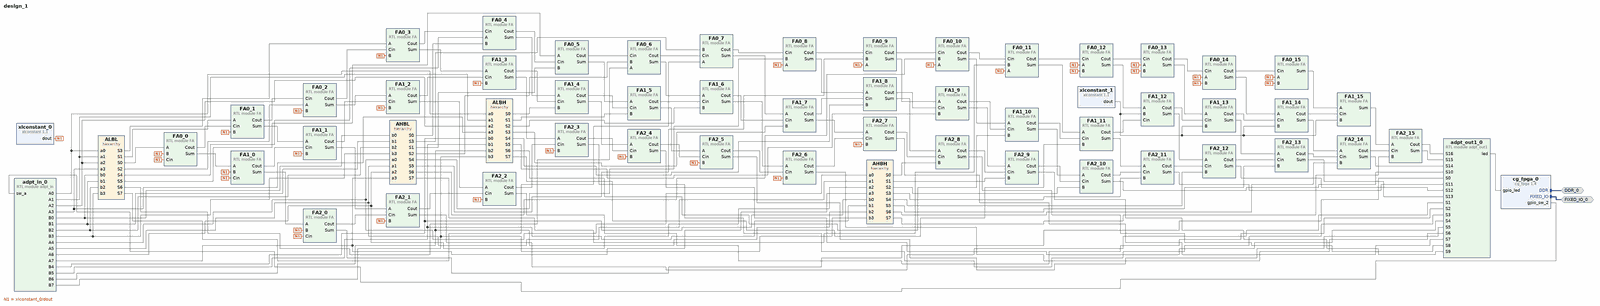
[diagram p0: block diagram of the top level, whole]
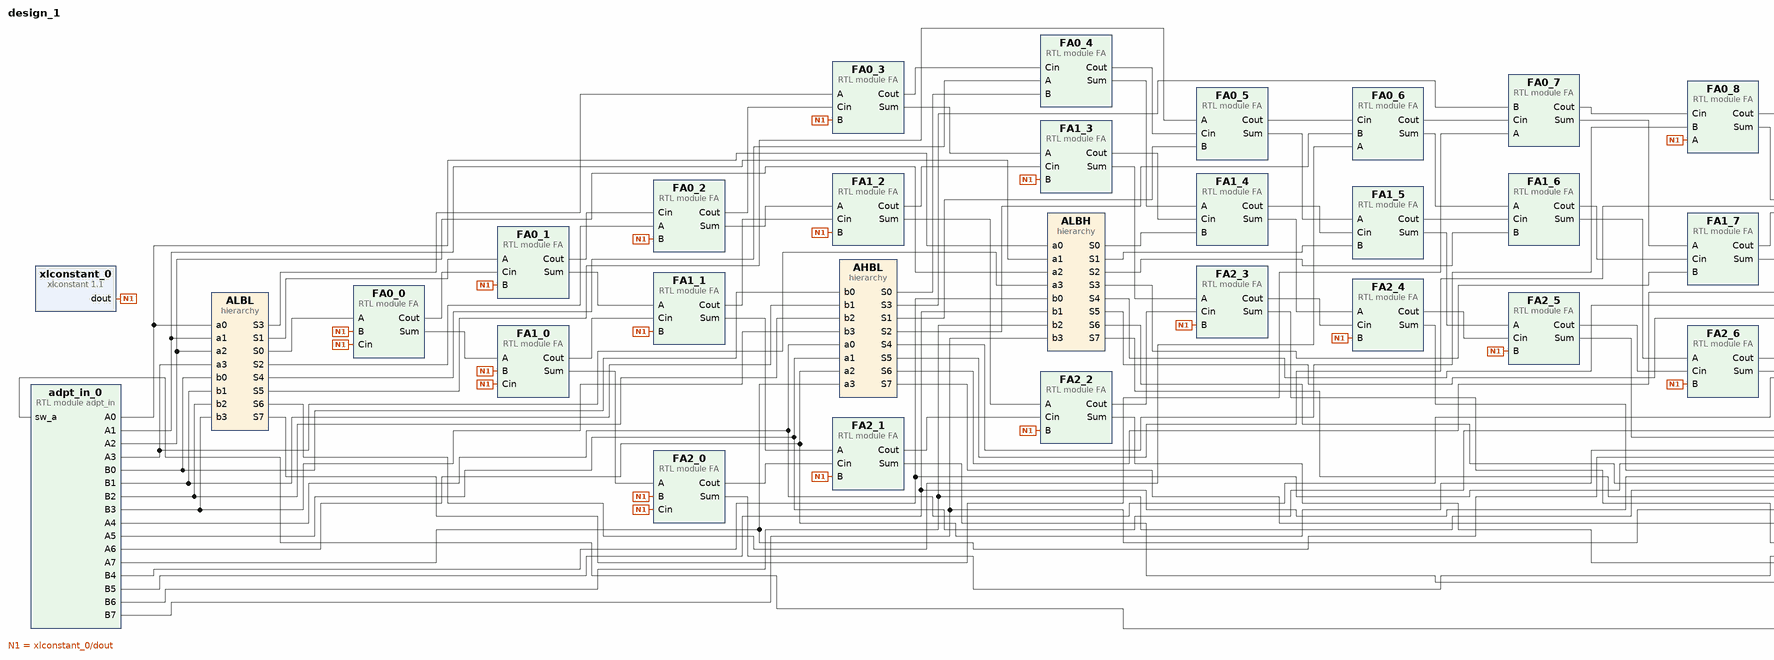
[diagram p1: block diagram of the top level, left part]
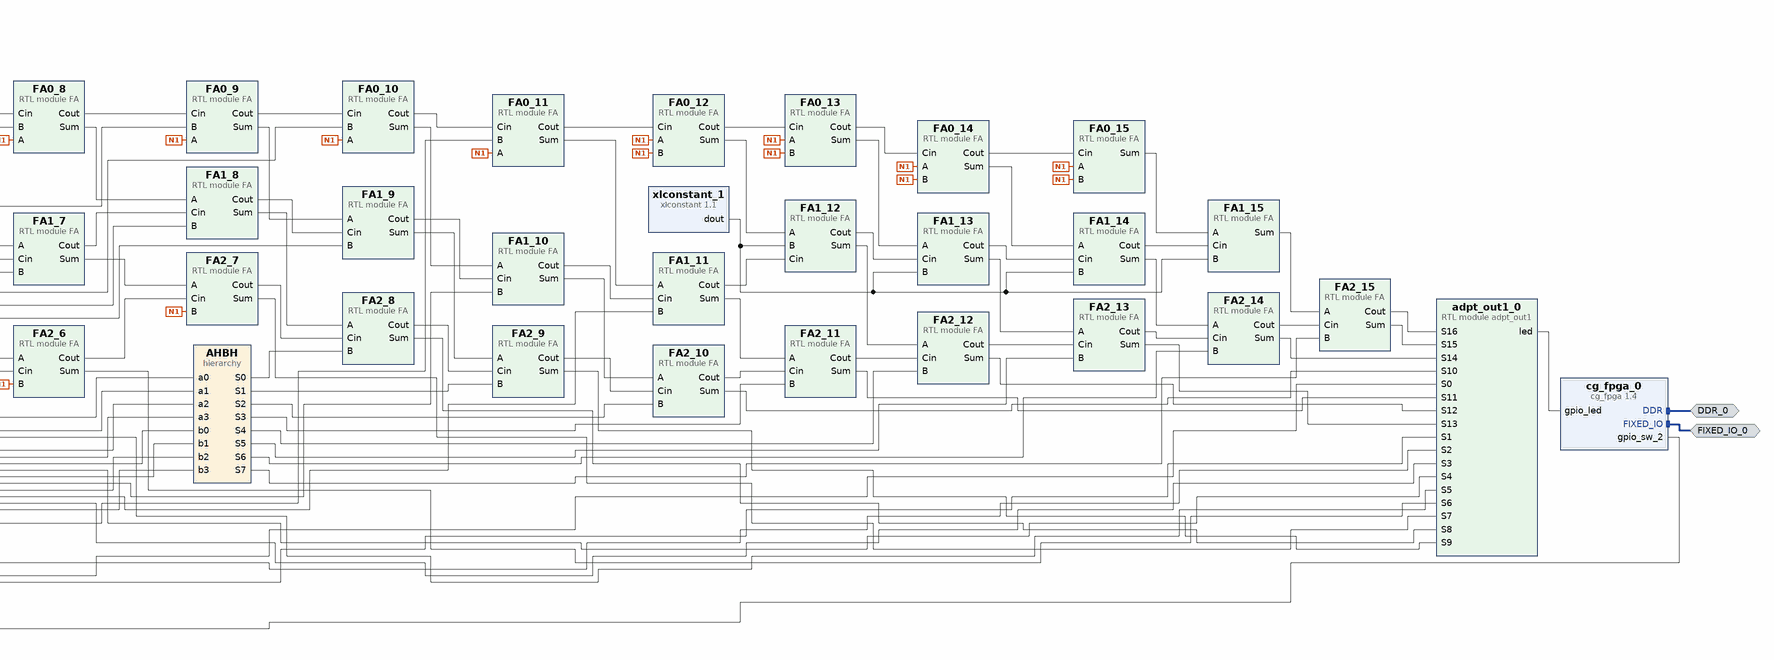
[diagram p2: block diagram of the top level, right part]
# Vivado block design design_1, xc7z020clg400-1, Vivado 2025.1
create_bd_design design_1

create_bd_intf_port -mode Master -vlnv xilinx.com:display_processing_system7:fixedio_rtl:1.0 FIXED_IO_0
create_bd_intf_port -mode Master -vlnv xilinx.com:interface:ddrx_rtl:1.0 DDR_0

create_bd_cell -type ip -vlnv educg.net:user:cg_fpga:1.4 cg_fpga_0
create_bd_cell -type module -reference adpt_in adpt_in_0
create_bd_cell -type hier ALBL
create_bd_cell -type hier ALBH
create_bd_cell -type hier AHBL
create_bd_cell -type hier AHBH
create_bd_cell -type module -reference adpt_out1 adpt_out1_0
create_bd_cell -type module -reference FA FA0_11
create_bd_cell -type module -reference FA FA0_12
create_bd_cell -type module -reference FA FA0_0
create_bd_cell -type module -reference FA FA0_1
create_bd_cell -type module -reference FA FA0_13
create_bd_cell -type module -reference FA FA0_14
create_bd_cell -type module -reference FA FA0_2
create_bd_cell -type module -reference FA FA0_3
create_bd_cell -type ip -vlnv xilinx.com:ip:xlconstant:1.1 xlconstant_0
set_property -dict {CONFIG.CONST_VAL 0} [get_bd_cells xlconstant_0]
create_bd_cell -type module -reference FA FA0_15
create_bd_cell -type module -reference FA FA0_4
create_bd_cell -type module -reference FA FA0_5
create_bd_cell -type module -reference FA FA0_6
create_bd_cell -type module -reference FA FA0_7
create_bd_cell -type module -reference FA FA0_8
create_bd_cell -type module -reference FA FA0_9
create_bd_cell -type module -reference FA FA0_10
create_bd_cell -type module -reference FA FA1_0
create_bd_cell -type module -reference FA FA1_1
create_bd_cell -type module -reference FA FA1_2
create_bd_cell -type module -reference FA FA1_3
create_bd_cell -type module -reference FA FA1_4
create_bd_cell -type module -reference FA FA1_5
create_bd_cell -type module -reference FA FA1_6
create_bd_cell -type module -reference FA FA1_7
create_bd_cell -type module -reference FA FA1_8
create_bd_cell -type module -reference FA FA1_9
create_bd_cell -type module -reference FA FA1_10
create_bd_cell -type module -reference FA FA1_11
create_bd_cell -type module -reference FA FA1_12
create_bd_cell -type module -reference FA FA1_13
create_bd_cell -type module -reference FA FA1_14
create_bd_cell -type module -reference FA FA1_15
create_bd_cell -type ip -vlnv xilinx.com:ip:xlconstant:1.1 xlconstant_1
set_property -dict {CONFIG.CONST_VAL 0} [get_bd_cells xlconstant_1]
create_bd_cell -type module -reference FA FA2_0
create_bd_cell -type module -reference FA FA2_1
create_bd_cell -type module -reference FA FA2_2
create_bd_cell -type module -reference FA FA2_3
create_bd_cell -type module -reference FA FA2_4
create_bd_cell -type module -reference FA FA2_5
create_bd_cell -type module -reference FA FA2_6
create_bd_cell -type module -reference FA FA2_7
create_bd_cell -type module -reference FA FA2_8
create_bd_cell -type module -reference FA FA2_9
create_bd_cell -type module -reference FA FA2_10
create_bd_cell -type module -reference FA FA2_11
create_bd_cell -type module -reference FA FA2_12
create_bd_cell -type module -reference FA FA2_13
create_bd_cell -type module -reference FA FA2_14
create_bd_cell -type module -reference FA FA2_15

# ---- hierarchy /ALBL ----
current_bd_instance /ALBL
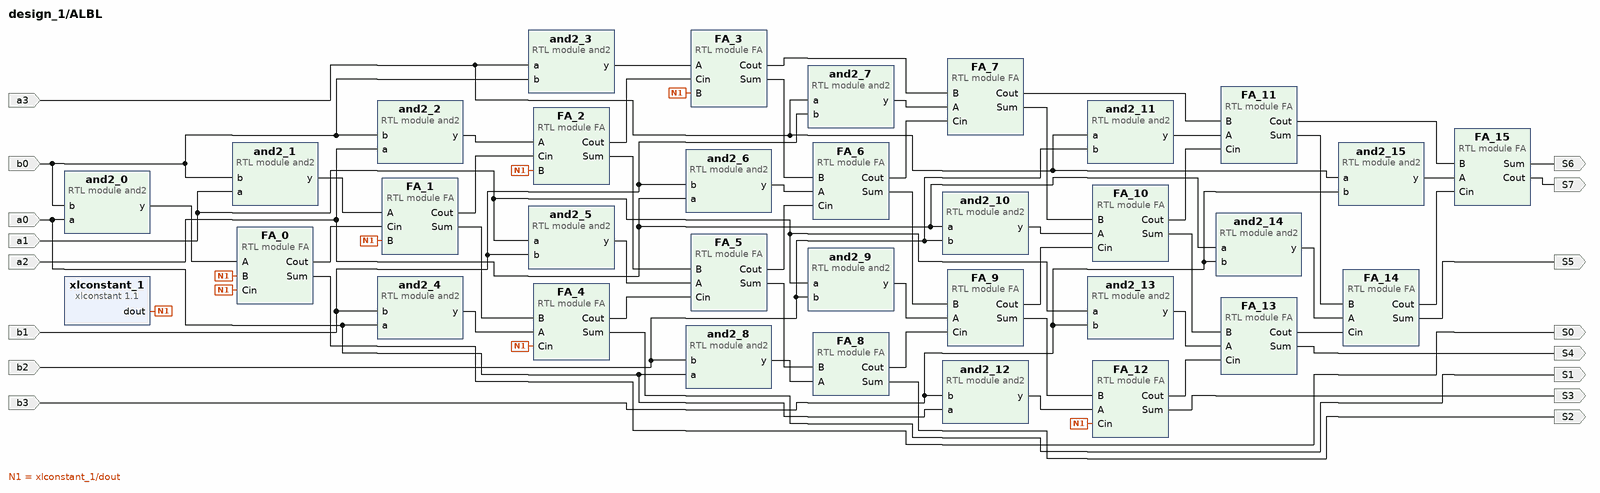
[diagram p3: block diagram inside /ALBL]
create_bd_pin -dir O S6
create_bd_pin -dir O S7
create_bd_pin -dir O S5
create_bd_pin -dir O S4
create_bd_pin -dir O S3
create_bd_pin -dir O S2
create_bd_pin -dir O S1
create_bd_pin -dir O S0
create_bd_pin -dir I a3
create_bd_pin -dir I b3
create_bd_pin -dir I a2
create_bd_pin -dir I a1
create_bd_pin -dir I a0
create_bd_pin -dir I b2
create_bd_pin -dir I b1
create_bd_pin -dir I b0

create_bd_cell -type module -reference FA FA_15
create_bd_cell -type module -reference FA FA_14
create_bd_cell -type module -reference FA FA_13
create_bd_cell -type module -reference FA FA_12
create_bd_cell -type module -reference FA FA_11
create_bd_cell -type module -reference FA FA_10
create_bd_cell -type module -reference FA FA_9
create_bd_cell -type module -reference FA FA_8
create_bd_cell -type module -reference FA FA_7
create_bd_cell -type module -reference FA FA_6
create_bd_cell -type module -reference FA FA_5
create_bd_cell -type module -reference FA FA_4
create_bd_cell -type module -reference FA FA_3
create_bd_cell -type module -reference FA FA_2
create_bd_cell -type module -reference FA FA_1
create_bd_cell -type module -reference FA FA_0
create_bd_cell -type module -reference and2 and2_15
create_bd_cell -type module -reference and2 and2_14
create_bd_cell -type module -reference and2 and2_13
create_bd_cell -type module -reference and2 and2_12
create_bd_cell -type module -reference and2 and2_11
create_bd_cell -type module -reference and2 and2_10
create_bd_cell -type module -reference and2 and2_9
create_bd_cell -type module -reference and2 and2_8
create_bd_cell -type module -reference and2 and2_7
create_bd_cell -type module -reference and2 and2_6
create_bd_cell -type module -reference and2 and2_5
create_bd_cell -type module -reference and2 and2_4
create_bd_cell -type module -reference and2 and2_3
create_bd_cell -type module -reference and2 and2_2
create_bd_cell -type module -reference and2 and2_1
create_bd_cell -type module -reference and2 and2_0
create_bd_cell -type ip -vlnv xilinx.com:ip:xlconstant:1.1 xlconstant_1
set_property -dict {CONFIG.CONST_VAL 0} [get_bd_cells xlconstant_1]

# ---- hierarchy /ALBH ----
current_bd_instance /ALBH
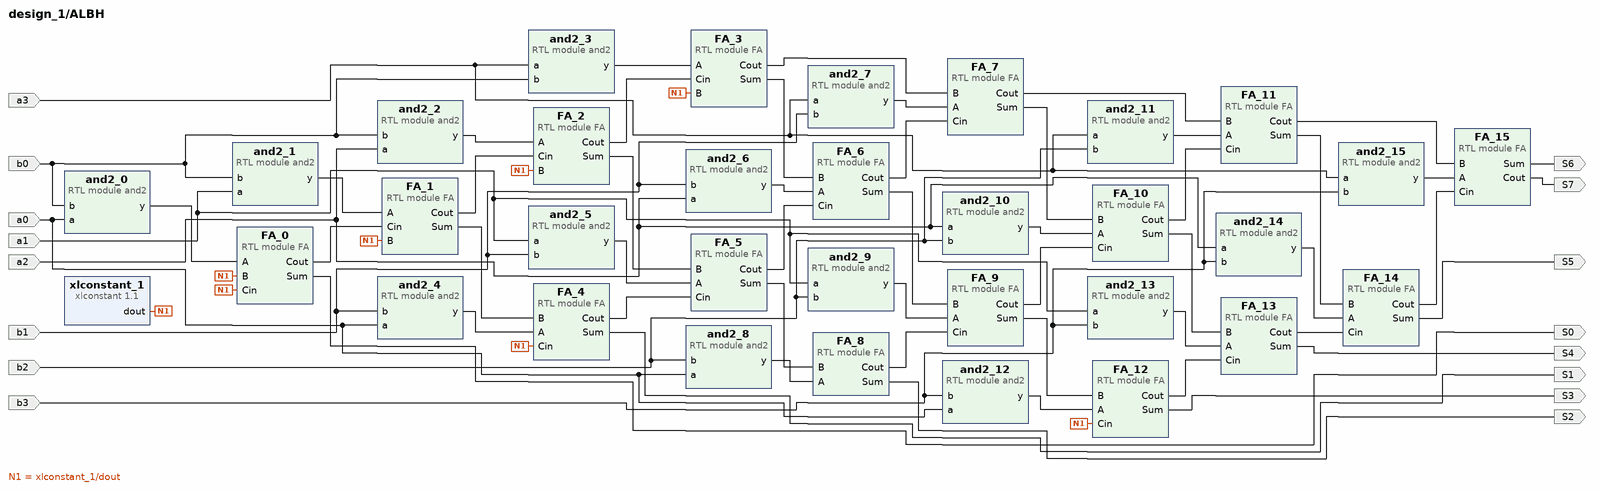
[diagram p4: block diagram inside /ALBH]
create_bd_pin -dir O S6
create_bd_pin -dir O S7
create_bd_pin -dir O S5
create_bd_pin -dir O S4
create_bd_pin -dir O S3
create_bd_pin -dir O S2
create_bd_pin -dir O S1
create_bd_pin -dir O S0
create_bd_pin -dir I a3
create_bd_pin -dir I b3
create_bd_pin -dir I a2
create_bd_pin -dir I a1
create_bd_pin -dir I a0
create_bd_pin -dir I b2
create_bd_pin -dir I b1
create_bd_pin -dir I b0

create_bd_cell -type module -reference FA FA_15
create_bd_cell -type module -reference FA FA_14
create_bd_cell -type module -reference FA FA_13
create_bd_cell -type module -reference FA FA_12
create_bd_cell -type module -reference FA FA_11
create_bd_cell -type module -reference FA FA_10
create_bd_cell -type module -reference FA FA_9
create_bd_cell -type module -reference FA FA_8
create_bd_cell -type module -reference FA FA_7
create_bd_cell -type module -reference FA FA_6
create_bd_cell -type module -reference FA FA_5
create_bd_cell -type module -reference FA FA_4
create_bd_cell -type module -reference FA FA_3
create_bd_cell -type module -reference FA FA_2
create_bd_cell -type module -reference FA FA_1
create_bd_cell -type module -reference FA FA_0
create_bd_cell -type module -reference and2 and2_15
create_bd_cell -type module -reference and2 and2_14
create_bd_cell -type module -reference and2 and2_13
create_bd_cell -type module -reference and2 and2_12
create_bd_cell -type module -reference and2 and2_11
create_bd_cell -type module -reference and2 and2_10
create_bd_cell -type module -reference and2 and2_9
create_bd_cell -type module -reference and2 and2_8
create_bd_cell -type module -reference and2 and2_7
create_bd_cell -type module -reference and2 and2_6
create_bd_cell -type module -reference and2 and2_5
create_bd_cell -type module -reference and2 and2_4
create_bd_cell -type module -reference and2 and2_3
create_bd_cell -type module -reference and2 and2_2
create_bd_cell -type module -reference and2 and2_1
create_bd_cell -type module -reference and2 and2_0
create_bd_cell -type ip -vlnv xilinx.com:ip:xlconstant:1.1 xlconstant_1
set_property -dict {CONFIG.CONST_VAL 0} [get_bd_cells xlconstant_1]

# ---- hierarchy /AHBL ----
current_bd_instance /AHBL
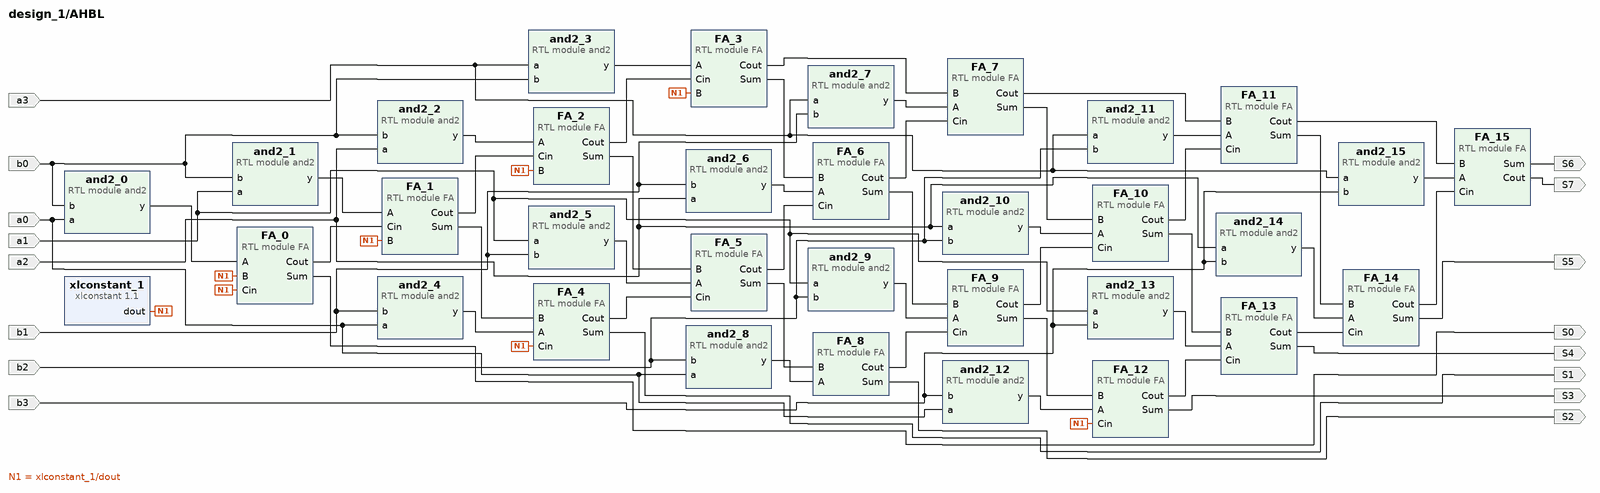
[diagram p5: block diagram inside /AHBL]
create_bd_pin -dir O S6
create_bd_pin -dir O S7
create_bd_pin -dir O S5
create_bd_pin -dir O S4
create_bd_pin -dir O S3
create_bd_pin -dir O S2
create_bd_pin -dir O S1
create_bd_pin -dir O S0
create_bd_pin -dir I a3
create_bd_pin -dir I b3
create_bd_pin -dir I a2
create_bd_pin -dir I a1
create_bd_pin -dir I a0
create_bd_pin -dir I b2
create_bd_pin -dir I b1
create_bd_pin -dir I b0

create_bd_cell -type module -reference FA FA_15
create_bd_cell -type module -reference FA FA_14
create_bd_cell -type module -reference FA FA_13
create_bd_cell -type module -reference FA FA_12
create_bd_cell -type module -reference FA FA_11
create_bd_cell -type module -reference FA FA_10
create_bd_cell -type module -reference FA FA_9
create_bd_cell -type module -reference FA FA_8
create_bd_cell -type module -reference FA FA_7
create_bd_cell -type module -reference FA FA_6
create_bd_cell -type module -reference FA FA_5
create_bd_cell -type module -reference FA FA_4
create_bd_cell -type module -reference FA FA_3
create_bd_cell -type module -reference FA FA_2
create_bd_cell -type module -reference FA FA_1
create_bd_cell -type module -reference FA FA_0
create_bd_cell -type module -reference and2 and2_15
create_bd_cell -type module -reference and2 and2_14
create_bd_cell -type module -reference and2 and2_13
create_bd_cell -type module -reference and2 and2_12
create_bd_cell -type module -reference and2 and2_11
create_bd_cell -type module -reference and2 and2_10
create_bd_cell -type module -reference and2 and2_9
create_bd_cell -type module -reference and2 and2_8
create_bd_cell -type module -reference and2 and2_7
create_bd_cell -type module -reference and2 and2_6
create_bd_cell -type module -reference and2 and2_5
create_bd_cell -type module -reference and2 and2_4
create_bd_cell -type module -reference and2 and2_3
create_bd_cell -type module -reference and2 and2_2
create_bd_cell -type module -reference and2 and2_1
create_bd_cell -type module -reference and2 and2_0
create_bd_cell -type ip -vlnv xilinx.com:ip:xlconstant:1.1 xlconstant_1
set_property -dict {CONFIG.CONST_VAL 0} [get_bd_cells xlconstant_1]

# ---- hierarchy /AHBH ----
current_bd_instance /AHBH
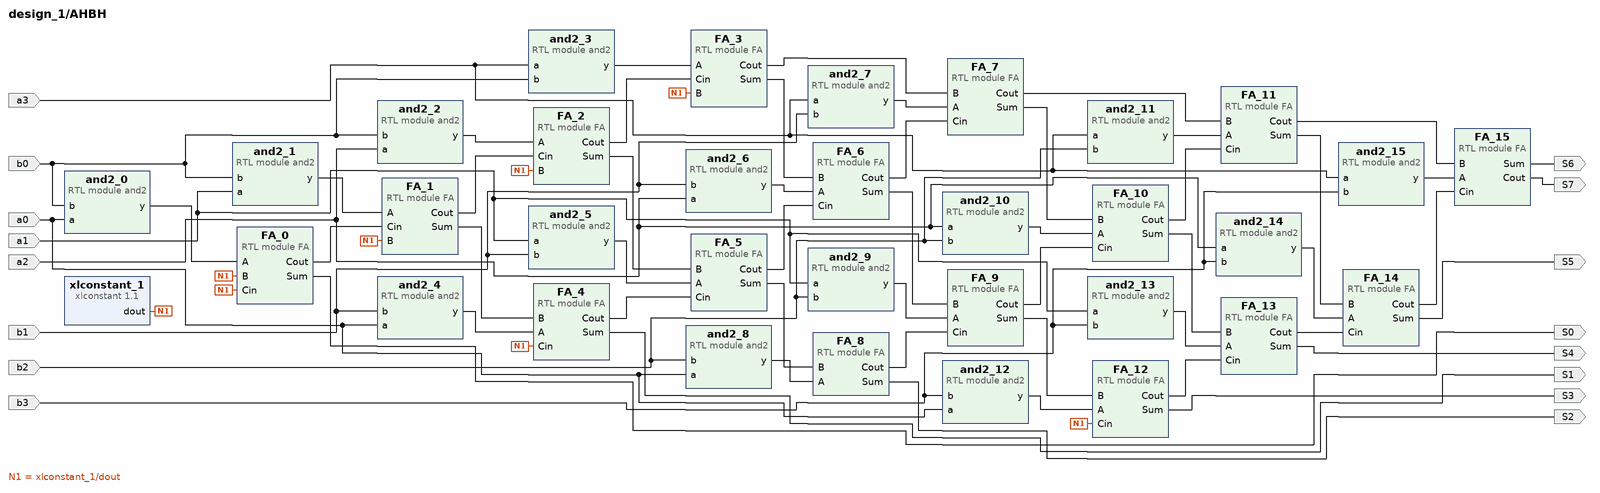
[diagram p6: block diagram inside /AHBH]
create_bd_pin -dir O S6
create_bd_pin -dir O S7
create_bd_pin -dir O S5
create_bd_pin -dir O S4
create_bd_pin -dir O S3
create_bd_pin -dir O S2
create_bd_pin -dir O S1
create_bd_pin -dir O S0
create_bd_pin -dir I a3
create_bd_pin -dir I b3
create_bd_pin -dir I a2
create_bd_pin -dir I a1
create_bd_pin -dir I a0
create_bd_pin -dir I b2
create_bd_pin -dir I b1
create_bd_pin -dir I b0

create_bd_cell -type module -reference FA FA_15
create_bd_cell -type module -reference FA FA_14
create_bd_cell -type module -reference FA FA_13
create_bd_cell -type module -reference FA FA_12
create_bd_cell -type module -reference FA FA_11
create_bd_cell -type module -reference FA FA_10
create_bd_cell -type module -reference FA FA_9
create_bd_cell -type module -reference FA FA_8
create_bd_cell -type module -reference FA FA_7
create_bd_cell -type module -reference FA FA_6
create_bd_cell -type module -reference FA FA_5
create_bd_cell -type module -reference FA FA_4
create_bd_cell -type module -reference FA FA_3
create_bd_cell -type module -reference FA FA_2
create_bd_cell -type module -reference FA FA_1
create_bd_cell -type module -reference FA FA_0
create_bd_cell -type module -reference and2 and2_15
create_bd_cell -type module -reference and2 and2_14
create_bd_cell -type module -reference and2 and2_13
create_bd_cell -type module -reference and2 and2_12
create_bd_cell -type module -reference and2 and2_11
create_bd_cell -type module -reference and2 and2_10
create_bd_cell -type module -reference and2 and2_9
create_bd_cell -type module -reference and2 and2_8
create_bd_cell -type module -reference and2 and2_7
create_bd_cell -type module -reference and2 and2_6
create_bd_cell -type module -reference and2 and2_5
create_bd_cell -type module -reference and2 and2_4
create_bd_cell -type module -reference and2 and2_3
create_bd_cell -type module -reference and2 and2_2
create_bd_cell -type module -reference and2 and2_1
create_bd_cell -type module -reference and2 and2_0
create_bd_cell -type ip -vlnv xilinx.com:ip:xlconstant:1.1 xlconstant_1
set_property -dict {CONFIG.CONST_VAL 0} [get_bd_cells xlconstant_1]

# ---- connections ----

current_bd_instance /ALBL
connect_bd_net [get_bd_pins FA_0/Cout] [get_bd_pins FA_1/Cin]
connect_bd_net [get_bd_pins FA_0/Sum] [get_bd_pins S0]
connect_bd_net [get_bd_pins FA_10/Cout] [get_bd_pins FA_11/Cin]
connect_bd_net [get_bd_pins FA_10/Sum] [get_bd_pins FA_13/B]
connect_bd_net [get_bd_pins FA_11/Cout] [get_bd_pins FA_15/B]
connect_bd_net [get_bd_pins FA_11/Sum] [get_bd_pins FA_14/B]
connect_bd_net [get_bd_pins FA_12/Cout] [get_bd_pins FA_13/Cin]
connect_bd_net [get_bd_pins FA_12/Sum] [get_bd_pins S3]
connect_bd_net [get_bd_pins FA_13/Cout] [get_bd_pins FA_14/Cin]
connect_bd_net [get_bd_pins FA_13/Sum] [get_bd_pins S4]
connect_bd_net [get_bd_pins FA_14/Cout] [get_bd_pins FA_15/Cin]
connect_bd_net [get_bd_pins FA_14/Sum] [get_bd_pins S5]
connect_bd_net [get_bd_pins FA_15/Cout] [get_bd_pins S7]
connect_bd_net [get_bd_pins FA_15/Sum] [get_bd_pins S6]
connect_bd_net [get_bd_pins FA_1/Cout] [get_bd_pins FA_2/Cin]
connect_bd_net [get_bd_pins FA_1/Sum] [get_bd_pins FA_4/B]
connect_bd_net [get_bd_pins FA_2/Cout] [get_bd_pins FA_3/Cin]
connect_bd_net [get_bd_pins FA_2/Sum] [get_bd_pins FA_5/B]
connect_bd_net [get_bd_pins FA_3/Cout] [get_bd_pins FA_7/B]
connect_bd_net [get_bd_pins FA_3/Sum] [get_bd_pins FA_6/B]
connect_bd_net [get_bd_pins FA_4/Cout] [get_bd_pins FA_5/Cin]
connect_bd_net [get_bd_pins FA_4/Sum] [get_bd_pins S1]
connect_bd_net [get_bd_pins FA_5/Cout] [get_bd_pins FA_6/Cin]
connect_bd_net [get_bd_pins FA_5/Sum] [get_bd_pins FA_8/B]
connect_bd_net [get_bd_pins FA_6/Cout] [get_bd_pins FA_7/Cin]
connect_bd_net [get_bd_pins FA_6/Sum] [get_bd_pins FA_9/B]
connect_bd_net [get_bd_pins FA_7/Cout] [get_bd_pins FA_11/B]
connect_bd_net [get_bd_pins FA_7/Sum] [get_bd_pins FA_10/B]
connect_bd_net [get_bd_pins FA_8/Cout] [get_bd_pins FA_9/Cin]
connect_bd_net [get_bd_pins FA_8/Sum] [get_bd_pins S2]
connect_bd_net [get_bd_pins FA_9/Cout] [get_bd_pins FA_10/Cin]
connect_bd_net [get_bd_pins FA_9/Sum] [get_bd_pins FA_12/B]
connect_bd_net -net adpt_in_0_A0 [get_bd_pins a0] [get_bd_pins and2_0/a] [get_bd_pins and2_4/a] [get_bd_pins and2_8/a] [get_bd_pins and2_12/a]
connect_bd_net -net adpt_in_0_A1 [get_bd_pins a1] [get_bd_pins and2_1/a] [get_bd_pins and2_5/a] [get_bd_pins and2_9/a] [get_bd_pins and2_13/a]
connect_bd_net -net adpt_in_0_A2 [get_bd_pins a2] [get_bd_pins and2_2/a] [get_bd_pins and2_6/a] [get_bd_pins and2_10/a] [get_bd_pins and2_14/a]
connect_bd_net -net adpt_in_0_A3 [get_bd_pins a3] [get_bd_pins and2_3/a] [get_bd_pins and2_7/a] [get_bd_pins and2_11/a] [get_bd_pins and2_15/a]
connect_bd_net -net adpt_in_0_B0 [get_bd_pins b0] [get_bd_pins and2_0/b] [get_bd_pins and2_1/b] [get_bd_pins and2_2/b] [get_bd_pins and2_3/b]
connect_bd_net -net adpt_in_0_B1 [get_bd_pins b1] [get_bd_pins and2_4/b] [get_bd_pins and2_5/b] [get_bd_pins and2_6/b] [get_bd_pins and2_7/b]
connect_bd_net -net adpt_in_0_B2 [get_bd_pins b2] [get_bd_pins and2_8/b] [get_bd_pins and2_9/b] [get_bd_pins and2_10/b] [get_bd_pins and2_11/b]
connect_bd_net -net adpt_in_0_B3 [get_bd_pins b3] [get_bd_pins and2_14/b] [get_bd_pins and2_13/b] [get_bd_pins and2_12/b] [get_bd_pins and2_15/b]
connect_bd_net [get_bd_pins and2_0/y] [get_bd_pins FA_0/A]
connect_bd_net [get_bd_pins and2_10/y] [get_bd_pins FA_10/A]
connect_bd_net [get_bd_pins and2_11/y] [get_bd_pins FA_11/A]
connect_bd_net [get_bd_pins and2_12/y] [get_bd_pins FA_12/A]
connect_bd_net [get_bd_pins and2_13/y] [get_bd_pins FA_13/A]
connect_bd_net [get_bd_pins and2_14/y] [get_bd_pins FA_14/A]
connect_bd_net [get_bd_pins and2_15/y] [get_bd_pins FA_15/A]
connect_bd_net [get_bd_pins and2_1/y] [get_bd_pins FA_1/A]
connect_bd_net [get_bd_pins and2_2/y] [get_bd_pins FA_2/A]
connect_bd_net [get_bd_pins and2_3/y] [get_bd_pins FA_3/A]
connect_bd_net [get_bd_pins and2_4/y] [get_bd_pins FA_4/A]
connect_bd_net [get_bd_pins and2_5/y] [get_bd_pins FA_5/A]
connect_bd_net [get_bd_pins and2_6/y] [get_bd_pins FA_6/A]
connect_bd_net [get_bd_pins and2_7/y] [get_bd_pins FA_7/A]
connect_bd_net [get_bd_pins and2_8/y] [get_bd_pins FA_8/A]
connect_bd_net [get_bd_pins and2_9/y] [get_bd_pins FA_9/A]
connect_bd_net -net xlconstant_0_dout [get_bd_pins xlconstant_1/dout] \
  [get_bd_pins FA_0/B] [get_bd_pins FA_0/Cin] [get_bd_pins FA_1/B] [get_bd_pins FA_2/B] [get_bd_pins FA_3/B] \
  [get_bd_pins FA_4/Cin] [get_bd_pins FA_12/Cin]

current_bd_instance /ALBH
connect_bd_net [get_bd_pins FA_0/Cout] [get_bd_pins FA_1/Cin]
connect_bd_net [get_bd_pins FA_0/Sum] [get_bd_pins S0]
connect_bd_net [get_bd_pins FA_10/Cout] [get_bd_pins FA_11/Cin]
connect_bd_net [get_bd_pins FA_10/Sum] [get_bd_pins FA_13/B]
connect_bd_net [get_bd_pins FA_11/Cout] [get_bd_pins FA_15/B]
connect_bd_net [get_bd_pins FA_11/Sum] [get_bd_pins FA_14/B]
connect_bd_net [get_bd_pins FA_12/Cout] [get_bd_pins FA_13/Cin]
connect_bd_net [get_bd_pins FA_12/Sum] [get_bd_pins S3]
connect_bd_net [get_bd_pins FA_13/Cout] [get_bd_pins FA_14/Cin]
connect_bd_net [get_bd_pins FA_13/Sum] [get_bd_pins S4]
connect_bd_net [get_bd_pins FA_14/Cout] [get_bd_pins FA_15/Cin]
connect_bd_net [get_bd_pins FA_14/Sum] [get_bd_pins S5]
connect_bd_net [get_bd_pins FA_15/Cout] [get_bd_pins S7]
connect_bd_net [get_bd_pins FA_15/Sum] [get_bd_pins S6]
connect_bd_net [get_bd_pins FA_1/Cout] [get_bd_pins FA_2/Cin]
connect_bd_net [get_bd_pins FA_1/Sum] [get_bd_pins FA_4/B]
connect_bd_net [get_bd_pins FA_2/Cout] [get_bd_pins FA_3/Cin]
connect_bd_net [get_bd_pins FA_2/Sum] [get_bd_pins FA_5/B]
connect_bd_net [get_bd_pins FA_3/Cout] [get_bd_pins FA_7/B]
connect_bd_net [get_bd_pins FA_3/Sum] [get_bd_pins FA_6/B]
connect_bd_net [get_bd_pins FA_4/Cout] [get_bd_pins FA_5/Cin]
connect_bd_net [get_bd_pins FA_4/Sum] [get_bd_pins S1]
connect_bd_net [get_bd_pins FA_5/Cout] [get_bd_pins FA_6/Cin]
connect_bd_net [get_bd_pins FA_5/Sum] [get_bd_pins FA_8/B]
connect_bd_net [get_bd_pins FA_6/Cout] [get_bd_pins FA_7/Cin]
connect_bd_net [get_bd_pins FA_6/Sum] [get_bd_pins FA_9/B]
connect_bd_net [get_bd_pins FA_7/Cout] [get_bd_pins FA_11/B]
connect_bd_net [get_bd_pins FA_7/Sum] [get_bd_pins FA_10/B]
connect_bd_net [get_bd_pins FA_8/Cout] [get_bd_pins FA_9/Cin]
connect_bd_net [get_bd_pins FA_8/Sum] [get_bd_pins S2]
connect_bd_net [get_bd_pins FA_9/Cout] [get_bd_pins FA_10/Cin]
connect_bd_net [get_bd_pins FA_9/Sum] [get_bd_pins FA_12/B]
connect_bd_net -net adpt_in_0_A0 [get_bd_pins a0] [get_bd_pins and2_0/a] [get_bd_pins and2_4/a] [get_bd_pins and2_8/a] [get_bd_pins and2_12/a]
connect_bd_net -net adpt_in_0_A1 [get_bd_pins a1] [get_bd_pins and2_1/a] [get_bd_pins and2_5/a] [get_bd_pins and2_9/a] [get_bd_pins and2_13/a]
connect_bd_net -net adpt_in_0_A2 [get_bd_pins a2] [get_bd_pins and2_2/a] [get_bd_pins and2_6/a] [get_bd_pins and2_10/a] [get_bd_pins and2_14/a]
connect_bd_net -net adpt_in_0_A3 [get_bd_pins a3] [get_bd_pins and2_3/a] [get_bd_pins and2_7/a] [get_bd_pins and2_11/a] [get_bd_pins and2_15/a]
connect_bd_net -net adpt_in_0_B0 [get_bd_pins b0] [get_bd_pins and2_0/b] [get_bd_pins and2_1/b] [get_bd_pins and2_2/b] [get_bd_pins and2_3/b]
connect_bd_net -net adpt_in_0_B1 [get_bd_pins b1] [get_bd_pins and2_4/b] [get_bd_pins and2_5/b] [get_bd_pins and2_6/b] [get_bd_pins and2_7/b]
connect_bd_net -net adpt_in_0_B2 [get_bd_pins b2] [get_bd_pins and2_8/b] [get_bd_pins and2_9/b] [get_bd_pins and2_10/b] [get_bd_pins and2_11/b]
connect_bd_net -net adpt_in_0_B3 [get_bd_pins b3] [get_bd_pins and2_14/b] [get_bd_pins and2_13/b] [get_bd_pins and2_12/b] [get_bd_pins and2_15/b]
connect_bd_net [get_bd_pins and2_0/y] [get_bd_pins FA_0/A]
connect_bd_net [get_bd_pins and2_10/y] [get_bd_pins FA_10/A]
connect_bd_net [get_bd_pins and2_11/y] [get_bd_pins FA_11/A]
connect_bd_net [get_bd_pins and2_12/y] [get_bd_pins FA_12/A]
connect_bd_net [get_bd_pins and2_13/y] [get_bd_pins FA_13/A]
connect_bd_net [get_bd_pins and2_14/y] [get_bd_pins FA_14/A]
connect_bd_net [get_bd_pins and2_15/y] [get_bd_pins FA_15/A]
connect_bd_net [get_bd_pins and2_1/y] [get_bd_pins FA_1/A]
connect_bd_net [get_bd_pins and2_2/y] [get_bd_pins FA_2/A]
connect_bd_net [get_bd_pins and2_3/y] [get_bd_pins FA_3/A]
connect_bd_net [get_bd_pins and2_4/y] [get_bd_pins FA_4/A]
connect_bd_net [get_bd_pins and2_5/y] [get_bd_pins FA_5/A]
connect_bd_net [get_bd_pins and2_6/y] [get_bd_pins FA_6/A]
connect_bd_net [get_bd_pins and2_7/y] [get_bd_pins FA_7/A]
connect_bd_net [get_bd_pins and2_8/y] [get_bd_pins FA_8/A]
connect_bd_net [get_bd_pins and2_9/y] [get_bd_pins FA_9/A]
connect_bd_net -net xlconstant_0_dout [get_bd_pins xlconstant_1/dout] \
  [get_bd_pins FA_0/B] [get_bd_pins FA_0/Cin] [get_bd_pins FA_1/B] [get_bd_pins FA_2/B] [get_bd_pins FA_3/B] \
  [get_bd_pins FA_4/Cin] [get_bd_pins FA_12/Cin]

current_bd_instance /AHBL
connect_bd_net [get_bd_pins FA_0/Cout] [get_bd_pins FA_1/Cin]
connect_bd_net [get_bd_pins FA_0/Sum] [get_bd_pins S0]
connect_bd_net [get_bd_pins FA_10/Cout] [get_bd_pins FA_11/Cin]
connect_bd_net [get_bd_pins FA_10/Sum] [get_bd_pins FA_13/B]
connect_bd_net [get_bd_pins FA_11/Cout] [get_bd_pins FA_15/B]
connect_bd_net [get_bd_pins FA_11/Sum] [get_bd_pins FA_14/B]
connect_bd_net [get_bd_pins FA_12/Cout] [get_bd_pins FA_13/Cin]
connect_bd_net [get_bd_pins FA_12/Sum] [get_bd_pins S3]
connect_bd_net [get_bd_pins FA_13/Cout] [get_bd_pins FA_14/Cin]
connect_bd_net [get_bd_pins FA_13/Sum] [get_bd_pins S4]
connect_bd_net [get_bd_pins FA_14/Cout] [get_bd_pins FA_15/Cin]
connect_bd_net [get_bd_pins FA_14/Sum] [get_bd_pins S5]
connect_bd_net [get_bd_pins FA_15/Cout] [get_bd_pins S7]
connect_bd_net [get_bd_pins FA_15/Sum] [get_bd_pins S6]
connect_bd_net [get_bd_pins FA_1/Cout] [get_bd_pins FA_2/Cin]
connect_bd_net [get_bd_pins FA_1/Sum] [get_bd_pins FA_4/B]
connect_bd_net [get_bd_pins FA_2/Cout] [get_bd_pins FA_3/Cin]
connect_bd_net [get_bd_pins FA_2/Sum] [get_bd_pins FA_5/B]
connect_bd_net [get_bd_pins FA_3/Cout] [get_bd_pins FA_7/B]
connect_bd_net [get_bd_pins FA_3/Sum] [get_bd_pins FA_6/B]
connect_bd_net [get_bd_pins FA_4/Cout] [get_bd_pins FA_5/Cin]
connect_bd_net [get_bd_pins FA_4/Sum] [get_bd_pins S1]
connect_bd_net [get_bd_pins FA_5/Cout] [get_bd_pins FA_6/Cin]
connect_bd_net [get_bd_pins FA_5/Sum] [get_bd_pins FA_8/B]
connect_bd_net [get_bd_pins FA_6/Cout] [get_bd_pins FA_7/Cin]
connect_bd_net [get_bd_pins FA_6/Sum] [get_bd_pins FA_9/B]
connect_bd_net [get_bd_pins FA_7/Cout] [get_bd_pins FA_11/B]
connect_bd_net [get_bd_pins FA_7/Sum] [get_bd_pins FA_10/B]
connect_bd_net [get_bd_pins FA_8/Cout] [get_bd_pins FA_9/Cin]
connect_bd_net [get_bd_pins FA_8/Sum] [get_bd_pins S2]
connect_bd_net [get_bd_pins FA_9/Cout] [get_bd_pins FA_10/Cin]
connect_bd_net [get_bd_pins FA_9/Sum] [get_bd_pins FA_12/B]
connect_bd_net -net adpt_in_0_A0 [get_bd_pins a0] [get_bd_pins and2_0/a] [get_bd_pins and2_4/a] [get_bd_pins and2_8/a] [get_bd_pins and2_12/a]
connect_bd_net -net adpt_in_0_A1 [get_bd_pins a1] [get_bd_pins and2_1/a] [get_bd_pins and2_5/a] [get_bd_pins and2_9/a] [get_bd_pins and2_13/a]
connect_bd_net -net adpt_in_0_A2 [get_bd_pins a2] [get_bd_pins and2_2/a] [get_bd_pins and2_6/a] [get_bd_pins and2_10/a] [get_bd_pins and2_14/a]
connect_bd_net -net adpt_in_0_A3 [get_bd_pins a3] [get_bd_pins and2_3/a] [get_bd_pins and2_7/a] [get_bd_pins and2_11/a] [get_bd_pins and2_15/a]
connect_bd_net -net adpt_in_0_B0 [get_bd_pins b0] [get_bd_pins and2_0/b] [get_bd_pins and2_1/b] [get_bd_pins and2_2/b] [get_bd_pins and2_3/b]
connect_bd_net -net adpt_in_0_B1 [get_bd_pins b1] [get_bd_pins and2_4/b] [get_bd_pins and2_5/b] [get_bd_pins and2_6/b] [get_bd_pins and2_7/b]
connect_bd_net -net adpt_in_0_B2 [get_bd_pins b2] [get_bd_pins and2_8/b] [get_bd_pins and2_9/b] [get_bd_pins and2_10/b] [get_bd_pins and2_11/b]
connect_bd_net -net adpt_in_0_B3 [get_bd_pins b3] [get_bd_pins and2_14/b] [get_bd_pins and2_13/b] [get_bd_pins and2_12/b] [get_bd_pins and2_15/b]
connect_bd_net [get_bd_pins and2_0/y] [get_bd_pins FA_0/A]
connect_bd_net [get_bd_pins and2_10/y] [get_bd_pins FA_10/A]
connect_bd_net [get_bd_pins and2_11/y] [get_bd_pins FA_11/A]
connect_bd_net [get_bd_pins and2_12/y] [get_bd_pins FA_12/A]
connect_bd_net [get_bd_pins and2_13/y] [get_bd_pins FA_13/A]
connect_bd_net [get_bd_pins and2_14/y] [get_bd_pins FA_14/A]
connect_bd_net [get_bd_pins and2_15/y] [get_bd_pins FA_15/A]
connect_bd_net [get_bd_pins and2_1/y] [get_bd_pins FA_1/A]
connect_bd_net [get_bd_pins and2_2/y] [get_bd_pins FA_2/A]
connect_bd_net [get_bd_pins and2_3/y] [get_bd_pins FA_3/A]
connect_bd_net [get_bd_pins and2_4/y] [get_bd_pins FA_4/A]
connect_bd_net [get_bd_pins and2_5/y] [get_bd_pins FA_5/A]
connect_bd_net [get_bd_pins and2_6/y] [get_bd_pins FA_6/A]
connect_bd_net [get_bd_pins and2_7/y] [get_bd_pins FA_7/A]
connect_bd_net [get_bd_pins and2_8/y] [get_bd_pins FA_8/A]
connect_bd_net [get_bd_pins and2_9/y] [get_bd_pins FA_9/A]
connect_bd_net -net xlconstant_0_dout [get_bd_pins xlconstant_1/dout] \
  [get_bd_pins FA_0/B] [get_bd_pins FA_0/Cin] [get_bd_pins FA_1/B] [get_bd_pins FA_2/B] [get_bd_pins FA_3/B] \
  [get_bd_pins FA_4/Cin] [get_bd_pins FA_12/Cin]

current_bd_instance /AHBH
connect_bd_net [get_bd_pins FA_0/Cout] [get_bd_pins FA_1/Cin]
connect_bd_net [get_bd_pins FA_0/Sum] [get_bd_pins S0]
connect_bd_net [get_bd_pins FA_10/Cout] [get_bd_pins FA_11/Cin]
connect_bd_net [get_bd_pins FA_10/Sum] [get_bd_pins FA_13/B]
connect_bd_net [get_bd_pins FA_11/Cout] [get_bd_pins FA_15/B]
connect_bd_net [get_bd_pins FA_11/Sum] [get_bd_pins FA_14/B]
connect_bd_net [get_bd_pins FA_12/Cout] [get_bd_pins FA_13/Cin]
connect_bd_net [get_bd_pins FA_12/Sum] [get_bd_pins S3]
connect_bd_net [get_bd_pins FA_13/Cout] [get_bd_pins FA_14/Cin]
connect_bd_net [get_bd_pins FA_13/Sum] [get_bd_pins S4]
connect_bd_net [get_bd_pins FA_14/Cout] [get_bd_pins FA_15/Cin]
connect_bd_net [get_bd_pins FA_14/Sum] [get_bd_pins S5]
connect_bd_net [get_bd_pins FA_15/Cout] [get_bd_pins S7]
connect_bd_net [get_bd_pins FA_15/Sum] [get_bd_pins S6]
connect_bd_net [get_bd_pins FA_1/Cout] [get_bd_pins FA_2/Cin]
connect_bd_net [get_bd_pins FA_1/Sum] [get_bd_pins FA_4/B]
connect_bd_net [get_bd_pins FA_2/Cout] [get_bd_pins FA_3/Cin]
connect_bd_net [get_bd_pins FA_2/Sum] [get_bd_pins FA_5/B]
connect_bd_net [get_bd_pins FA_3/Cout] [get_bd_pins FA_7/B]
connect_bd_net [get_bd_pins FA_3/Sum] [get_bd_pins FA_6/B]
connect_bd_net [get_bd_pins FA_4/Cout] [get_bd_pins FA_5/Cin]
connect_bd_net [get_bd_pins FA_4/Sum] [get_bd_pins S1]
connect_bd_net [get_bd_pins FA_5/Cout] [get_bd_pins FA_6/Cin]
connect_bd_net [get_bd_pins FA_5/Sum] [get_bd_pins FA_8/B]
connect_bd_net [get_bd_pins FA_6/Cout] [get_bd_pins FA_7/Cin]
connect_bd_net [get_bd_pins FA_6/Sum] [get_bd_pins FA_9/B]
connect_bd_net [get_bd_pins FA_7/Cout] [get_bd_pins FA_11/B]
connect_bd_net [get_bd_pins FA_7/Sum] [get_bd_pins FA_10/B]
connect_bd_net [get_bd_pins FA_8/Cout] [get_bd_pins FA_9/Cin]
connect_bd_net [get_bd_pins FA_8/Sum] [get_bd_pins S2]
connect_bd_net [get_bd_pins FA_9/Cout] [get_bd_pins FA_10/Cin]
connect_bd_net [get_bd_pins FA_9/Sum] [get_bd_pins FA_12/B]
connect_bd_net -net adpt_in_0_A0 [get_bd_pins a0] [get_bd_pins and2_0/a] [get_bd_pins and2_4/a] [get_bd_pins and2_8/a] [get_bd_pins and2_12/a]
connect_bd_net -net adpt_in_0_A1 [get_bd_pins a1] [get_bd_pins and2_1/a] [get_bd_pins and2_5/a] [get_bd_pins and2_9/a] [get_bd_pins and2_13/a]
connect_bd_net -net adpt_in_0_A2 [get_bd_pins a2] [get_bd_pins and2_2/a] [get_bd_pins and2_6/a] [get_bd_pins and2_10/a] [get_bd_pins and2_14/a]
connect_bd_net -net adpt_in_0_A3 [get_bd_pins a3] [get_bd_pins and2_3/a] [get_bd_pins and2_7/a] [get_bd_pins and2_11/a] [get_bd_pins and2_15/a]
connect_bd_net -net adpt_in_0_B0 [get_bd_pins b0] [get_bd_pins and2_0/b] [get_bd_pins and2_1/b] [get_bd_pins and2_2/b] [get_bd_pins and2_3/b]
connect_bd_net -net adpt_in_0_B1 [get_bd_pins b1] [get_bd_pins and2_4/b] [get_bd_pins and2_5/b] [get_bd_pins and2_6/b] [get_bd_pins and2_7/b]
connect_bd_net -net adpt_in_0_B2 [get_bd_pins b2] [get_bd_pins and2_8/b] [get_bd_pins and2_9/b] [get_bd_pins and2_10/b] [get_bd_pins and2_11/b]
connect_bd_net -net adpt_in_0_B3 [get_bd_pins b3] [get_bd_pins and2_14/b] [get_bd_pins and2_13/b] [get_bd_pins and2_12/b] [get_bd_pins and2_15/b]
connect_bd_net [get_bd_pins and2_0/y] [get_bd_pins FA_0/A]
connect_bd_net [get_bd_pins and2_10/y] [get_bd_pins FA_10/A]
connect_bd_net [get_bd_pins and2_11/y] [get_bd_pins FA_11/A]
connect_bd_net [get_bd_pins and2_12/y] [get_bd_pins FA_12/A]
connect_bd_net [get_bd_pins and2_13/y] [get_bd_pins FA_13/A]
connect_bd_net [get_bd_pins and2_14/y] [get_bd_pins FA_14/A]
connect_bd_net [get_bd_pins and2_15/y] [get_bd_pins FA_15/A]
connect_bd_net [get_bd_pins and2_1/y] [get_bd_pins FA_1/A]
connect_bd_net [get_bd_pins and2_2/y] [get_bd_pins FA_2/A]
connect_bd_net [get_bd_pins and2_3/y] [get_bd_pins FA_3/A]
connect_bd_net [get_bd_pins and2_4/y] [get_bd_pins FA_4/A]
connect_bd_net [get_bd_pins and2_5/y] [get_bd_pins FA_5/A]
connect_bd_net [get_bd_pins and2_6/y] [get_bd_pins FA_6/A]
connect_bd_net [get_bd_pins and2_7/y] [get_bd_pins FA_7/A]
connect_bd_net [get_bd_pins and2_8/y] [get_bd_pins FA_8/A]
connect_bd_net [get_bd_pins and2_9/y] [get_bd_pins FA_9/A]
connect_bd_net -net xlconstant_0_dout [get_bd_pins xlconstant_1/dout] \
  [get_bd_pins FA_0/B] [get_bd_pins FA_0/Cin] [get_bd_pins FA_1/B] [get_bd_pins FA_2/B] [get_bd_pins FA_3/B] \
  [get_bd_pins FA_4/Cin] [get_bd_pins FA_12/Cin]

current_bd_instance /
connect_bd_intf_net [get_bd_intf_ports DDR_0] [get_bd_intf_pins cg_fpga_0/DDR]
connect_bd_intf_net [get_bd_intf_ports FIXED_IO_0] [get_bd_intf_pins cg_fpga_0/FIXED_IO]
connect_bd_net [get_bd_pins AHBH/S0] [get_bd_pins FA2_8/B]
connect_bd_net [get_bd_pins AHBH/S1] [get_bd_pins FA2_9/B]
connect_bd_net [get_bd_pins AHBH/S2] [get_bd_pins FA2_10/B]
connect_bd_net [get_bd_pins AHBH/S3] [get_bd_pins FA2_11/B]
connect_bd_net [get_bd_pins AHBH/S4] [get_bd_pins FA2_12/B]
connect_bd_net [get_bd_pins AHBH/S5] [get_bd_pins FA2_13/B]
connect_bd_net [get_bd_pins AHBH/S6] [get_bd_pins FA2_14/B]
connect_bd_net [get_bd_pins AHBH/S7] [get_bd_pins FA2_15/B]
connect_bd_net [get_bd_pins AHBL/S0] [get_bd_pins FA0_4/B]
connect_bd_net [get_bd_pins AHBL/S1] [get_bd_pins FA0_5/B]
connect_bd_net [get_bd_pins AHBL/S2] [get_bd_pins FA0_6/B]
connect_bd_net [get_bd_pins AHBL/S3] [get_bd_pins FA0_7/B]
connect_bd_net [get_bd_pins AHBL/S4] [get_bd_pins FA0_8/B]
connect_bd_net [get_bd_pins AHBL/S5] [get_bd_pins FA0_9/B]
connect_bd_net [get_bd_pins AHBL/S6] [get_bd_pins FA0_10/B]
connect_bd_net [get_bd_pins AHBL/S7] [get_bd_pins FA0_11/B]
connect_bd_net [get_bd_pins ALBH/S0] [get_bd_pins FA1_4/B]
connect_bd_net [get_bd_pins ALBH/S1] [get_bd_pins FA1_5/B]
connect_bd_net [get_bd_pins ALBH/S2] [get_bd_pins FA1_6/B]
connect_bd_net [get_bd_pins ALBH/S3] [get_bd_pins FA1_7/B]
connect_bd_net [get_bd_pins ALBH/S4] [get_bd_pins FA1_8/B]
connect_bd_net [get_bd_pins ALBH/S5] [get_bd_pins FA1_9/B]
connect_bd_net [get_bd_pins ALBH/S6] [get_bd_pins FA1_10/B]
connect_bd_net [get_bd_pins ALBH/S7] [get_bd_pins FA1_11/B]
connect_bd_net [get_bd_pins ALBL/S0] [get_bd_pins FA0_0/A]
connect_bd_net [get_bd_pins ALBL/S1] [get_bd_pins FA0_1/A]
connect_bd_net [get_bd_pins ALBL/S2] [get_bd_pins FA0_2/A]
connect_bd_net [get_bd_pins ALBL/S3] [get_bd_pins FA0_3/A]
connect_bd_net [get_bd_pins ALBL/S4] [get_bd_pins FA0_4/A]
connect_bd_net [get_bd_pins ALBL/S5] [get_bd_pins FA0_5/A]
connect_bd_net [get_bd_pins ALBL/S6] [get_bd_pins FA0_6/A]
connect_bd_net [get_bd_pins ALBL/S7] [get_bd_pins FA0_7/A]
connect_bd_net [get_bd_pins FA0_0/Sum] [get_bd_pins FA1_0/A]
connect_bd_net [get_bd_pins FA0_10/Sum] [get_bd_pins FA1_10/A]
connect_bd_net [get_bd_pins FA0_11/Sum] [get_bd_pins FA1_11/A]
connect_bd_net [get_bd_pins FA0_12/Sum] [get_bd_pins FA1_12/A]
connect_bd_net [get_bd_pins FA0_13/Sum] [get_bd_pins FA1_13/A]
connect_bd_net [get_bd_pins FA0_14/Sum] [get_bd_pins FA1_14/A]
connect_bd_net [get_bd_pins FA0_15/Sum] [get_bd_pins FA1_15/A]
connect_bd_net [get_bd_pins FA0_1/Sum] [get_bd_pins FA1_1/A]
connect_bd_net [get_bd_pins FA0_2/Sum] [get_bd_pins FA1_2/A]
connect_bd_net [get_bd_pins FA0_3/Sum] [get_bd_pins FA1_3/A]
connect_bd_net [get_bd_pins FA0_4/Sum] [get_bd_pins FA1_4/A]
connect_bd_net [get_bd_pins FA0_5/Sum] [get_bd_pins FA1_5/A]
connect_bd_net [get_bd_pins FA0_6/Sum] [get_bd_pins FA1_6/A]
connect_bd_net [get_bd_pins FA0_7/Sum] [get_bd_pins FA1_7/A]
connect_bd_net [get_bd_pins FA0_8/Sum] [get_bd_pins FA1_8/A]
connect_bd_net [get_bd_pins FA0_9/Sum] [get_bd_pins FA1_9/A]
connect_bd_net [get_bd_pins FA1_0/Cout] [get_bd_pins FA1_1/Cin]
connect_bd_net [get_bd_pins FA1_0/Sum] [get_bd_pins FA2_0/A]
connect_bd_net [get_bd_pins FA1_10/Cout] [get_bd_pins FA1_11/Cin]
connect_bd_net [get_bd_pins FA1_10/Sum] [get_bd_pins FA2_10/A]
connect_bd_net [get_bd_pins FA1_11/Cout] [get_bd_pins FA1_12/Cin]
connect_bd_net [get_bd_pins FA1_11/Sum] [get_bd_pins FA2_11/A]
connect_bd_net [get_bd_pins FA1_12/Cout] [get_bd_pins FA1_13/Cin]
connect_bd_net [get_bd_pins FA1_12/Sum] [get_bd_pins FA2_12/A]
connect_bd_net [get_bd_pins FA1_13/Cout] [get_bd_pins FA1_14/Cin]
connect_bd_net [get_bd_pins FA1_13/Sum] [get_bd_pins FA2_13/A]
connect_bd_net [get_bd_pins FA1_14/Cout] [get_bd_pins FA1_15/Cin]
connect_bd_net [get_bd_pins FA1_14/Sum] [get_bd_pins FA2_14/A]
connect_bd_net [get_bd_pins FA1_15/Sum] [get_bd_pins FA2_15/A]
connect_bd_net [get_bd_pins FA1_1/Cout] [get_bd_pins FA1_2/Cin]
connect_bd_net [get_bd_pins FA1_1/Sum] [get_bd_pins FA2_1/A]
connect_bd_net [get_bd_pins FA1_2/Cout] [get_bd_pins FA1_3/Cin]
connect_bd_net [get_bd_pins FA1_2/Sum] [get_bd_pins FA2_2/A]
connect_bd_net [get_bd_pins FA1_3/Cout] [get_bd_pins FA1_4/Cin]
connect_bd_net [get_bd_pins FA1_3/Sum] [get_bd_pins FA2_3/A]
connect_bd_net [get_bd_pins FA1_4/Cout] [get_bd_pins FA1_5/Cin]
connect_bd_net [get_bd_pins FA1_4/Sum] [get_bd_pins FA2_4/A]
connect_bd_net [get_bd_pins FA1_5/Cout] [get_bd_pins FA1_6/Cin]
connect_bd_net [get_bd_pins FA1_5/Sum] [get_bd_pins FA2_5/A]
connect_bd_net [get_bd_pins FA1_6/Cout] [get_bd_pins FA1_7/Cin]
connect_bd_net [get_bd_pins FA1_6/Sum] [get_bd_pins FA2_6/A]
connect_bd_net [get_bd_pins FA1_7/Cout] [get_bd_pins FA1_8/Cin]
connect_bd_net [get_bd_pins FA1_7/Sum] [get_bd_pins FA2_7/A]
connect_bd_net [get_bd_pins FA1_8/Cout] [get_bd_pins FA1_9/Cin]
connect_bd_net [get_bd_pins FA1_8/Sum] [get_bd_pins FA2_8/A]
connect_bd_net [get_bd_pins FA1_9/Cout] [get_bd_pins FA1_10/Cin]
connect_bd_net [get_bd_pins FA1_9/Sum] [get_bd_pins FA2_9/A]
connect_bd_net [get_bd_pins FA2_0/Cout] [get_bd_pins FA2_1/Cin]
connect_bd_net [get_bd_pins FA2_0/Sum] [get_bd_pins adpt_out1_0/S0]
connect_bd_net [get_bd_pins FA2_10/Cout] [get_bd_pins FA2_11/Cin]
connect_bd_net [get_bd_pins FA2_10/Sum] [get_bd_pins adpt_out1_0/S10]
connect_bd_net [get_bd_pins FA2_11/Cout] [get_bd_pins FA2_12/Cin]
connect_bd_net [get_bd_pins FA2_11/Sum] [get_bd_pins adpt_out1_0/S11]
connect_bd_net [get_bd_pins FA2_12/Cout] [get_bd_pins FA2_13/Cin]
connect_bd_net [get_bd_pins FA2_12/Sum] [get_bd_pins adpt_out1_0/S12]
connect_bd_net [get_bd_pins FA2_13/Cout] [get_bd_pins FA2_14/Cin]
connect_bd_net [get_bd_pins FA2_13/Sum] [get_bd_pins adpt_out1_0/S13]
connect_bd_net [get_bd_pins FA2_14/Cout] [get_bd_pins FA2_15/Cin]
connect_bd_net [get_bd_pins FA2_14/Sum] [get_bd_pins adpt_out1_0/S14]
connect_bd_net [get_bd_pins FA2_15/Cout] [get_bd_pins adpt_out1_0/S16]
connect_bd_net [get_bd_pins FA2_15/Sum] [get_bd_pins adpt_out1_0/S15]
connect_bd_net [get_bd_pins FA2_1/Cout] [get_bd_pins FA2_2/Cin]
connect_bd_net [get_bd_pins FA2_1/Sum] [get_bd_pins adpt_out1_0/S1]
connect_bd_net [get_bd_pins FA2_2/Cout] [get_bd_pins FA2_3/Cin]
connect_bd_net [get_bd_pins FA2_2/Sum] [get_bd_pins adpt_out1_0/S2]
connect_bd_net [get_bd_pins FA2_3/Cout] [get_bd_pins FA2_4/Cin]
connect_bd_net [get_bd_pins FA2_3/Sum] [get_bd_pins adpt_out1_0/S3]
connect_bd_net [get_bd_pins FA2_4/Cout] [get_bd_pins FA2_5/Cin]
connect_bd_net [get_bd_pins FA2_4/Sum] [get_bd_pins adpt_out1_0/S4]
connect_bd_net [get_bd_pins FA2_5/Cout] [get_bd_pins FA2_6/Cin]
connect_bd_net [get_bd_pins FA2_5/Sum] [get_bd_pins adpt_out1_0/S5]
connect_bd_net [get_bd_pins FA2_6/Cout] [get_bd_pins FA2_7/Cin]
connect_bd_net [get_bd_pins FA2_6/Sum] [get_bd_pins adpt_out1_0/S6]
connect_bd_net [get_bd_pins FA2_7/Cout] [get_bd_pins FA2_8/Cin]
connect_bd_net [get_bd_pins FA2_7/Sum] [get_bd_pins adpt_out1_0/S7]
connect_bd_net [get_bd_pins FA2_8/Cout] [get_bd_pins FA2_9/Cin]
connect_bd_net [get_bd_pins FA2_8/Sum] [get_bd_pins adpt_out1_0/S8]
connect_bd_net [get_bd_pins FA2_9/Cout] [get_bd_pins FA2_10/Cin]
connect_bd_net [get_bd_pins FA2_9/Sum] [get_bd_pins adpt_out1_0/S9]
connect_bd_net -net FA_0_Cout [get_bd_pins FA0_0/Cout] [get_bd_pins FA0_1/Cin]
connect_bd_net -net FA_10_Cout [get_bd_pins FA0_10/Cout] [get_bd_pins FA0_11/Cin]
connect_bd_net -net FA_11_Cout [get_bd_pins FA0_11/Cout] [get_bd_pins FA0_12/Cin]
connect_bd_net -net FA_12_Cout [get_bd_pins FA0_12/Cout] [get_bd_pins FA0_13/Cin]
connect_bd_net -net FA_13_Cout [get_bd_pins FA0_13/Cout] [get_bd_pins FA0_14/Cin]
connect_bd_net -net FA_14_Cout [get_bd_pins FA0_14/Cout] [get_bd_pins FA0_15/Cin]
connect_bd_net -net FA_1_Cout [get_bd_pins FA0_1/Cout] [get_bd_pins FA0_2/Cin]
connect_bd_net -net FA_2_Cout [get_bd_pins FA0_2/Cout] [get_bd_pins FA0_3/Cin]
connect_bd_net -net FA_3_Cout [get_bd_pins FA0_3/Cout] [get_bd_pins FA0_4/Cin]
connect_bd_net -net FA_4_Cout [get_bd_pins FA0_4/Cout] [get_bd_pins FA0_5/Cin]
connect_bd_net -net FA_5_Cout [get_bd_pins FA0_5/Cout] [get_bd_pins FA0_6/Cin]
connect_bd_net -net FA_6_Cout [get_bd_pins FA0_6/Cout] [get_bd_pins FA0_7/Cin]
connect_bd_net -net FA_7_Cout [get_bd_pins FA0_7/Cout] [get_bd_pins FA0_8/Cin]
connect_bd_net -net FA_8_Cout [get_bd_pins FA0_8/Cout] [get_bd_pins FA0_9/Cin]
connect_bd_net -net FA_9_Cout [get_bd_pins FA0_9/Cout] [get_bd_pins FA0_10/Cin]
connect_bd_net [get_bd_pins adpt_in_0/A0] [get_bd_pins ALBL/a0] [get_bd_pins ALBH/a0]
connect_bd_net [get_bd_pins adpt_in_0/A1] [get_bd_pins ALBL/a1] [get_bd_pins ALBH/a1]
connect_bd_net [get_bd_pins adpt_in_0/A2] [get_bd_pins ALBL/a2] [get_bd_pins ALBH/a2]
connect_bd_net [get_bd_pins adpt_in_0/A3] [get_bd_pins ALBL/a3] [get_bd_pins ALBH/a3]
connect_bd_net [get_bd_pins adpt_in_0/A4] [get_bd_pins AHBL/a0] [get_bd_pins AHBH/a0]
connect_bd_net [get_bd_pins adpt_in_0/A5] [get_bd_pins AHBL/a1] [get_bd_pins AHBH/a1]
connect_bd_net [get_bd_pins adpt_in_0/A6] [get_bd_pins AHBL/a2] [get_bd_pins AHBH/a2]
connect_bd_net [get_bd_pins adpt_in_0/A7] [get_bd_pins AHBL/a3] [get_bd_pins AHBH/a3]
connect_bd_net [get_bd_pins adpt_in_0/B0] [get_bd_pins ALBL/b0] [get_bd_pins AHBL/b0]
connect_bd_net [get_bd_pins adpt_in_0/B1] [get_bd_pins ALBL/b1] [get_bd_pins AHBL/b1]
connect_bd_net [get_bd_pins adpt_in_0/B2] [get_bd_pins ALBL/b2] [get_bd_pins AHBL/b2]
connect_bd_net [get_bd_pins adpt_in_0/B3] [get_bd_pins ALBL/b3] [get_bd_pins AHBL/b3]
connect_bd_net [get_bd_pins adpt_in_0/B4] [get_bd_pins ALBH/b0] [get_bd_pins AHBH/b0]
connect_bd_net [get_bd_pins adpt_in_0/B5] [get_bd_pins ALBH/b1] [get_bd_pins AHBH/b1]
connect_bd_net [get_bd_pins adpt_in_0/B6] [get_bd_pins ALBH/b2] [get_bd_pins AHBH/b2]
connect_bd_net [get_bd_pins adpt_in_0/B7] [get_bd_pins ALBH/b3] [get_bd_pins AHBH/b3]
connect_bd_net [get_bd_pins adpt_out1_0/led] [get_bd_pins cg_fpga_0/gpio_led]
connect_bd_net [get_bd_pins cg_fpga_0/gpio_sw_2] [get_bd_pins adpt_in_0/sw_a]
connect_bd_net [get_bd_pins xlconstant_0/dout] \
  [get_bd_pins FA0_0/Cin] [get_bd_pins FA0_8/A] [get_bd_pins FA0_9/A] [get_bd_pins FA0_10/A] [get_bd_pins FA0_11/A] \
  [get_bd_pins FA0_12/A] [get_bd_pins FA0_13/A] [get_bd_pins FA0_14/A] [get_bd_pins FA0_15/A] [get_bd_pins FA0_0/B] \
  [get_bd_pins FA0_1/B] [get_bd_pins FA0_2/B] [get_bd_pins FA0_3/B] [get_bd_pins FA0_12/B] [get_bd_pins FA0_13/B] \
  [get_bd_pins FA0_14/B] [get_bd_pins FA0_15/B] [get_bd_pins FA1_0/B] [get_bd_pins FA1_0/Cin] [get_bd_pins FA1_1/B] \
  [get_bd_pins FA1_2/B] [get_bd_pins FA1_3/B] [get_bd_pins FA2_0/B] [get_bd_pins FA2_0/Cin] [get_bd_pins FA2_1/B] \
  [get_bd_pins FA2_2/B] [get_bd_pins FA2_3/B] [get_bd_pins FA2_4/B] [get_bd_pins FA2_5/B] [get_bd_pins FA2_6/B] \
  [get_bd_pins FA2_7/B]
connect_bd_net [get_bd_pins xlconstant_1/dout] [get_bd_pins FA1_12/B] [get_bd_pins FA1_13/B] [get_bd_pins FA1_14/B] [get_bd_pins FA1_15/B]

validate_bd_design
save_bd_design
